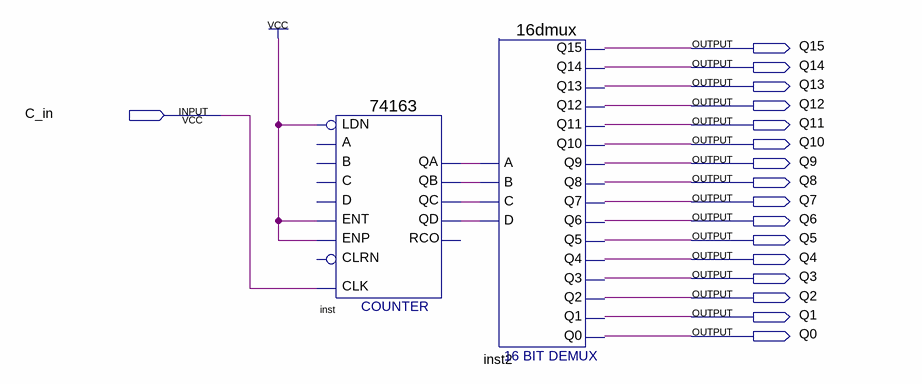
[diagram p0: schematic sheet]
// Quartus schematic Block2.bdf as structural Verilog: 2 symbols, 17 pins
module Block2 (
  input  C_in,
  output Q15,
  output Q14,
  output Q13,
  output Q12,
  output Q11,
  output Q10,
  output Q9,
  output Q8,
  output Q7,
  output Q6,
  output Q5,
  output Q4,
  output Q3,
  output Q2,
  output Q1,
  output Q0
);

  wire inst_qa, inst_qb, inst_qc, inst_qd;

  \74163  inst (
    .ENT(1'b1), .CLK(C_in), .ENP(1'b1), .LDN(1'b1), .QA(inst_qa), .QB(inst_qb), .QC(inst_qc), .QD(inst_qd));  // open: C, B, A, D, CLRN, RCO
  \16dmux  inst2 (
    .C(inst_qc), .B(inst_qb), .A(inst_qa), .D(inst_qd), .Q12(Q12), .Q13(Q13), .Q11(Q11), .Q9(Q9), .Q10(Q10),
    .Q7(Q7), .Q8(Q8), .Q4(Q4), .Q5(Q5), .Q6(Q6), .Q2(Q2), .Q3(Q3), .Q14(Q14), .Q15(Q15), .Q0(Q0), .Q1(Q1));
endmodule
